# EAGLE design ftdi (EAGLE 6.5.0)
FTDI BREAKOUT
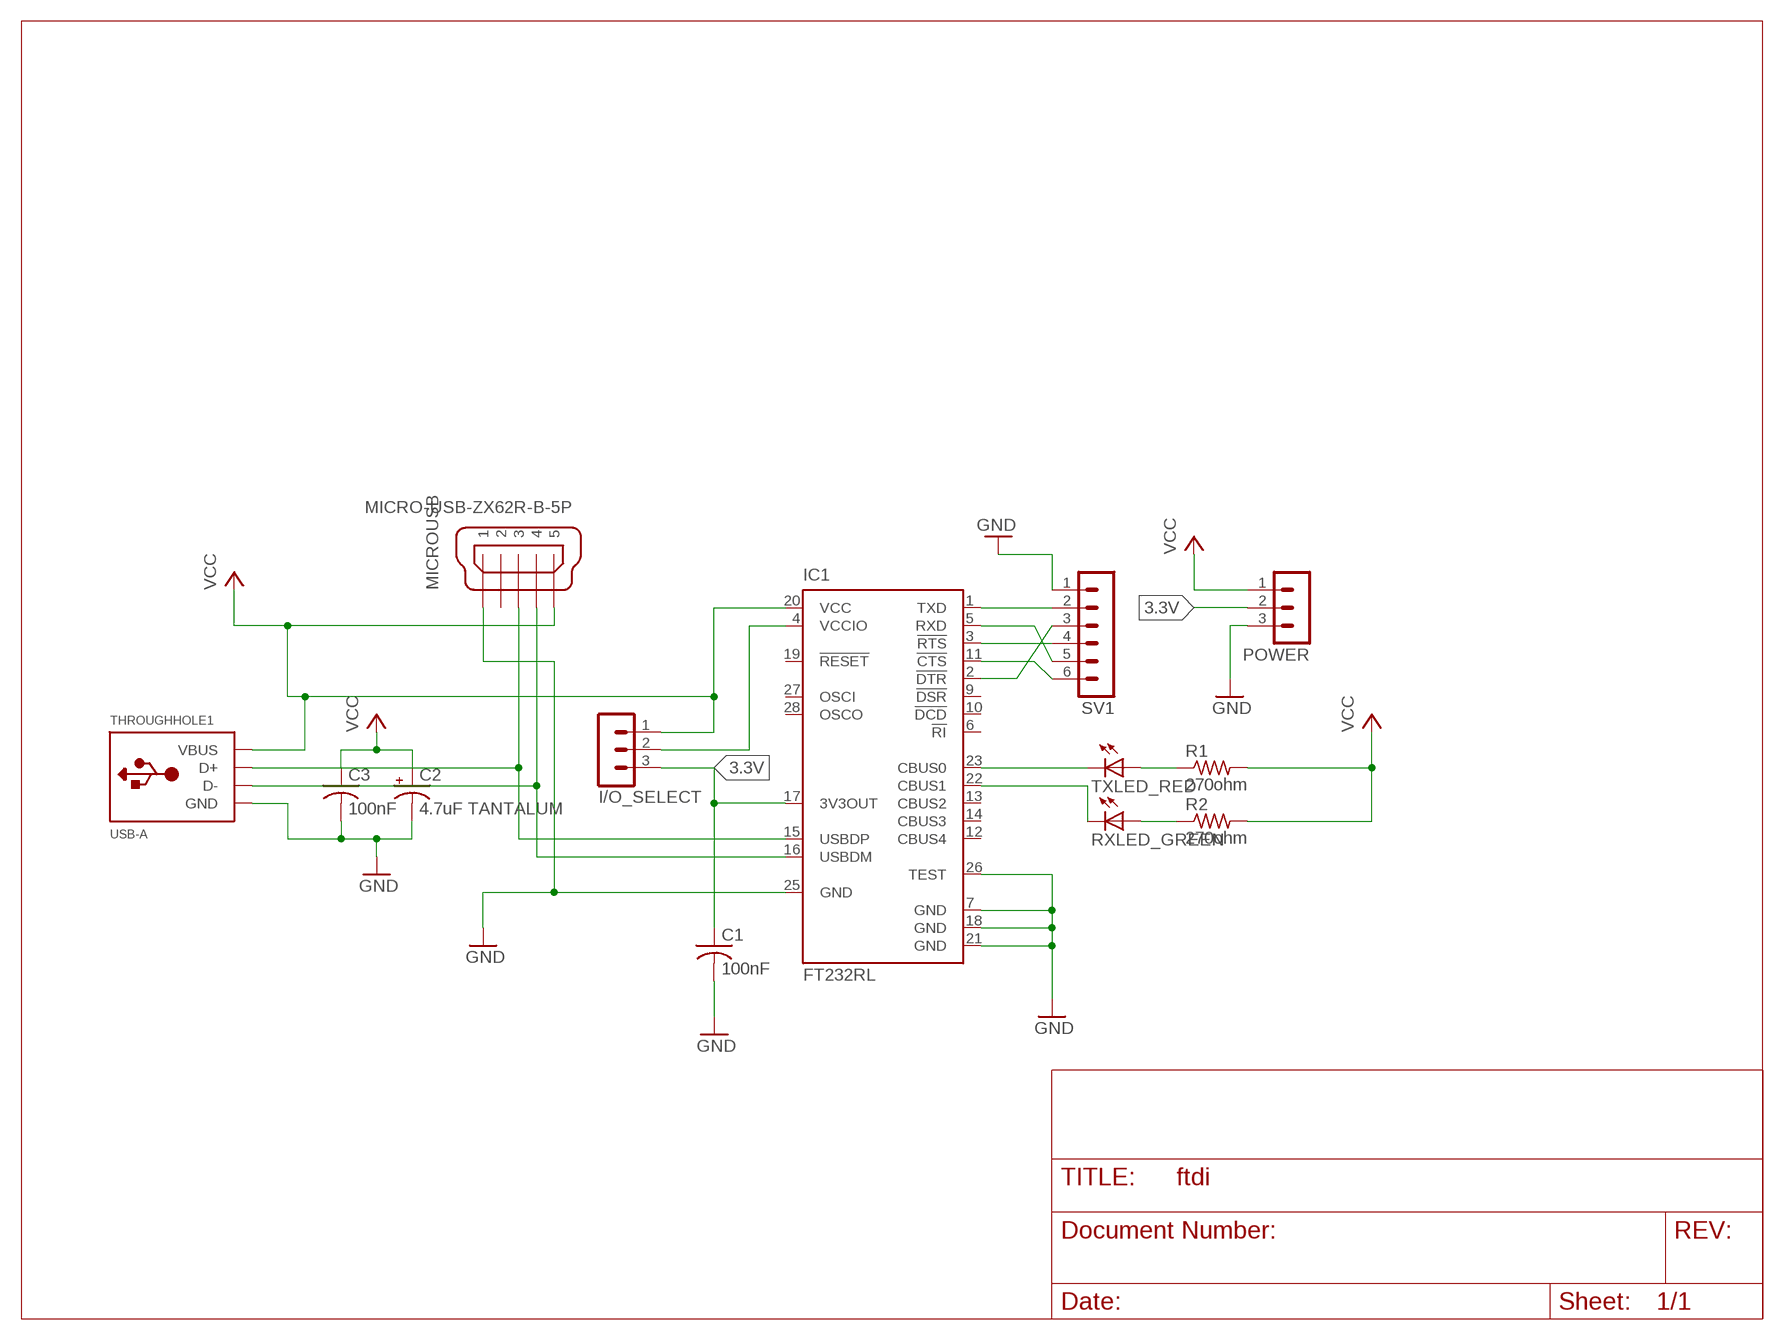
[diagram p0: schematic, sheet 1]

## Parts
C1  100nF  C-USC1206  [C1206]
C2  4.7uF TANTALUM  CPOL-USC/6032-28R  [C/6032-28R]
C3  100nF  C-USC1206  [C1206]
I/O_SELECT  MA03-1  [MA03-1]
IC1  FT232RL  [SSOP28]
MICROUSB  MICRO-USB-ZX62R-B-5P  [ZX62R-B-5P]
POWER  MA03-1  [MA03-1]
R1  270ohm  R-US_R1206  [R1206]
R2  270ohm  R-US_R1206  [R1206]
RXLED_GREEN  LED3MM  [LED3MM]
SV1  MA06-1  [MA06-1]
THROUGHHOLE1  USB-A  [MOLEX_480371000]
TXLED_RED  LED3MM  [LED3MM]

## Nets
3.3V: C1.1 I/O_SELECT.3 IC1.17(3V3OUT) POWER.2
GND: C1.2 C2.- C3.2 IC1.7(GND) IC1.18(GND) IC1.21(GND) IC1.25(GND) IC1.26(TEST) MICROUSB.1 POWER.3 SV1.1 THROUGHHOLE1.P$4(GND)
N$1: IC1.1(TXD) SV1.2
N$2: IC1.16(USBDM) MICROUSB.4 THROUGHHOLE1.P$2(D-)
N$3: IC1.15(USBDP) MICROUSB.3 THROUGHHOLE1.P$3(D+)
N$4: IC1.23(CBUS0) TXLED_RED.K(C)
N$6: I/O_SELECT.2 IC1.4(VCCIO)
N$7: R1.1 TXLED_RED.A
N$8: R2.1 RXLED_GREEN.A
N$9: IC1.2(!DTR) SV1.3
N$10: IC1.3(!RTS) SV1.4
N$11: IC1.5(RXD) SV1.5
N$12: IC1.11(!CTS) SV1.6
RXLED_RED: IC1.22(CBUS1) RXLED_GREEN.K(C)
VCC: C2.+ C3.1 I/O_SELECT.1 IC1.20(VCC) MICROUSB.5 POWER.1 R1.2 R2.2 THROUGHHOLE1.P$1(VBUS)
Unconnected: IC1.6(!RI) IC1.9(!DSR) IC1.10(!DCD) IC1.12(CBUS4) IC1.13(CBUS2) IC1.14(CBUS3) IC1.19(!RESET) IC1.27(OSCI) IC1.28(OSCO) MICROUSB.2

## Library data of the parts
C1 C3 = adafruit:C-US: CAPACITOR, American symbol
C2 = adafruit:CPOL-US: POLARIZED CAPACITOR, American symbol
I/O_SELECT POWER = con-lstb:MA03-1: PIN HEADER; OC_FARNELL: unknown; OC_NEWARK: unknown
IC1 = ftdichip:FT232R: Source: http://www.ftdichip.com/Documents/DataSheets/DS_FT232R_v104.pdf; MPN: FT232RL; OC_FARNELL: 1146032; OC_NEWARK: 91K9918
MICROUSB = con-hirose:MICRO-USB-: Hirose Micro USB Connector ZX62R-B-5P: Micro B, reverse (top mount) shell SMT Supplier: DigiKey H11574CT-ND Source: http://www.hirose.co.jp/cataloge_hp/e24200011.pdf
R1 R2 = adafruit:R-US_: RESISTOR, American symbol
RXLED_GREEN TXLED_RED = adafruit:LED: LED OSRAM: - CHIPLED LG R971, LG N971, LY N971, LG Q971, LY Q971, LO R971, LY R971 LH N974, LH R974 LS Q976, LO Q976, LY Q976 LO Q996 - Hyper CHIPLED LW Q18S LB Q993, LB Q99A, LB R99A - SideLED LS A670, LO A670, LY A670, LG A670, LP A670 LB A673, LV A673, LT A673, LW A673 LH A674 LY A675 LS A676, LA A676, LO A676, LY A676, LW A676 LS A679, LY A679, LG A679 - Hyper Micro SIDELED® LS Y876, LA Y876, LO Y876, LY Y876 LT Y87S - SmartLED LW L88C, LW L88S LB L89C, LB L89S, LG L890 LS L89K, LO L89K, LY L89K LS L896, LA L896, LO L896, LY L896 - TOPLED LS T670, LO T670, LY T670, LG T670, LP T670 LSG T670, LSP T670, LSY T670, LOP T670, LYG T670 LG T671, LOG T671, LSG T671 LB T673, LV T673, LT T673, LW T673 LH T674 LS T676, LA T676, LO T676, LY T676, LB T676, LH T676, LSB T676, LW T676 LB T67C, LV T67C, LT T67C, LS T67K, LO T67K, LY T67K, LW E67C LS E67B, LA E67B, LO E67B, LY E67B, LB E67C, LV E67C, LT E67C LW T67C LS T679, LY T679, LG T679 LS T770, LO T770, LY T770, LG T770, LP T770 LB T773, LV T773, LT T773, LW T773 LH T774 LS E675, LA E675, LY E675, LS T675 LS T776, LA T776, LO T776, LY T776, LB T776 LHGB T686 LT T68C, LB T68C - Hyper Mini TOPLED® LB M676 - Mini TOPLED Santana® LG M470 LS M47K, LO M47K, LY M47K Source: http://www.osram.convergy.de/
SV1 = con-lstb:MA06-1: PIN HEADER; OC_FARNELL: unknown; OC_NEWARK: unknown
THROUGHHOLE1 = adafruit_usb_a_through_hole:USB-A: USB type A 'plug' Used for things that can directly connect to a USB port, say USB key

## Board
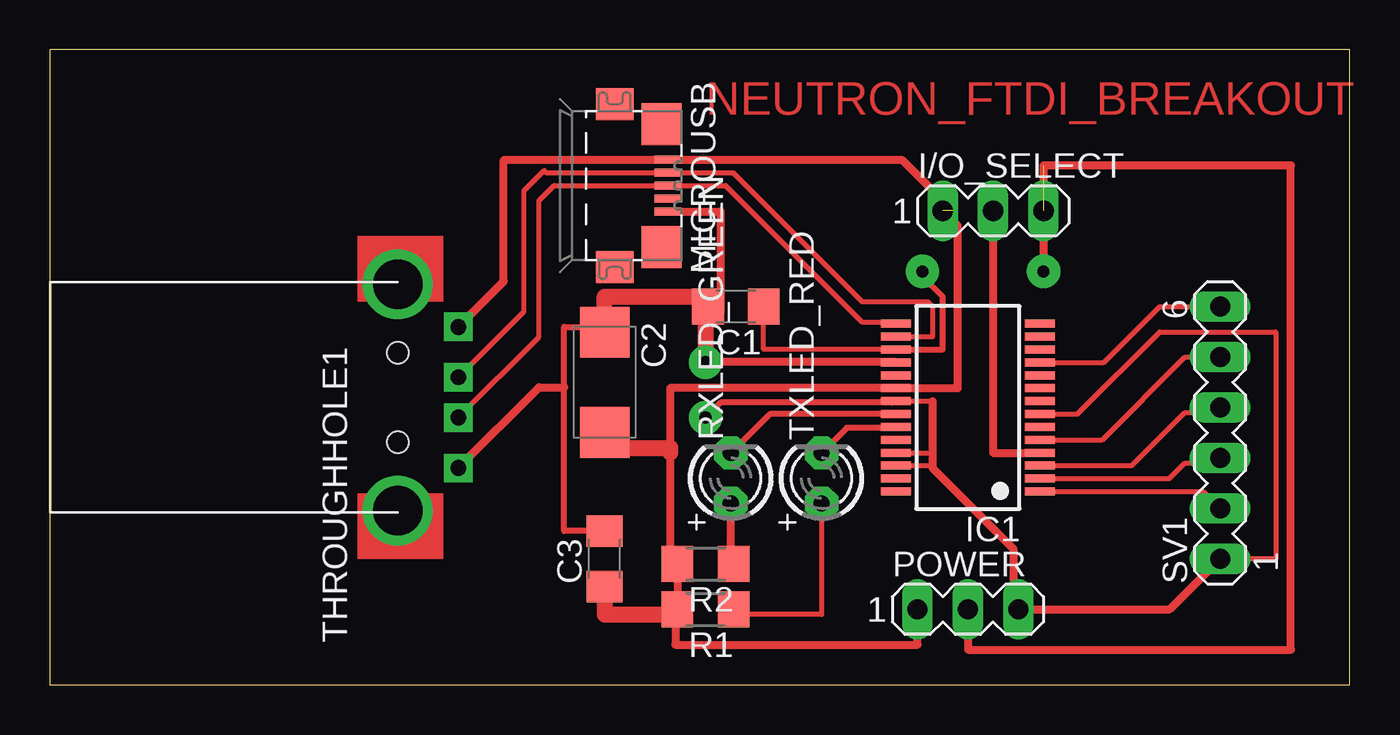
[diagram p1: board, top side]
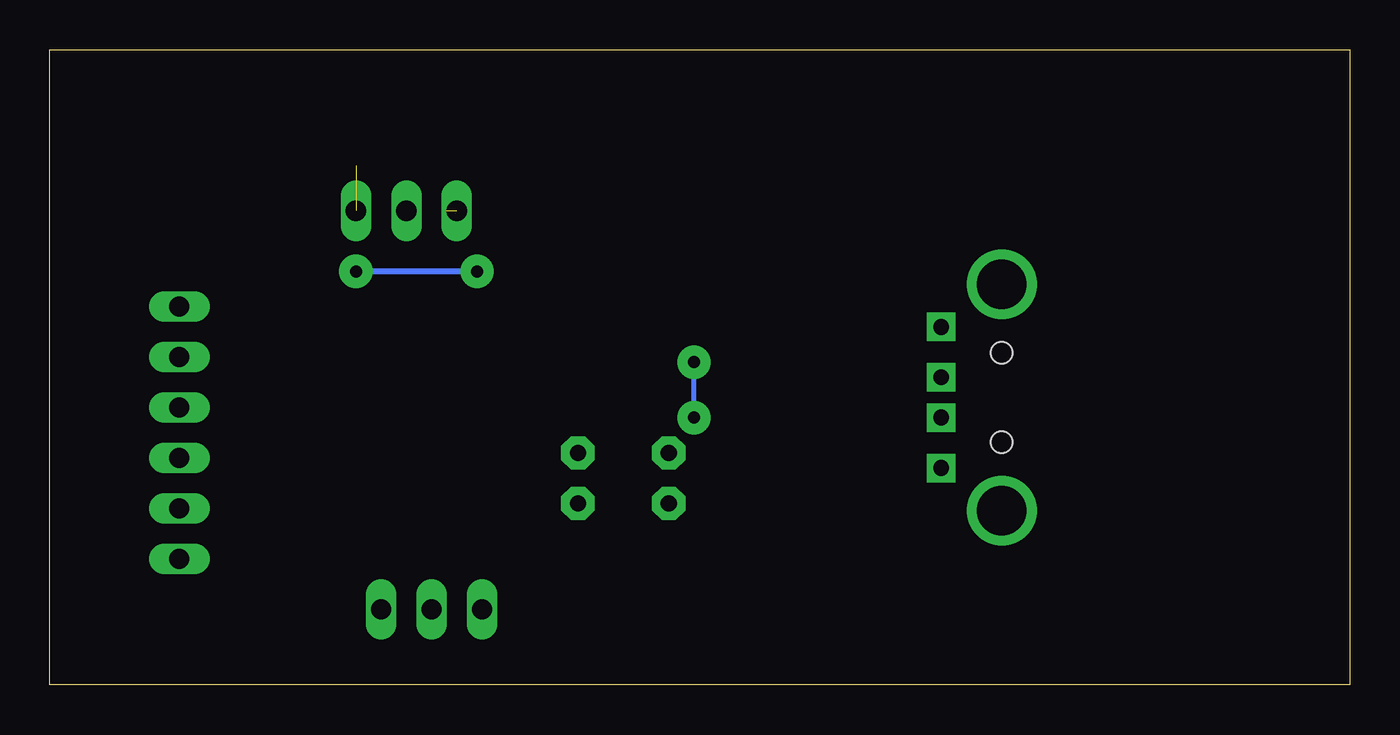
[diagram p2: board, bottom side, seen from below]

Size 65.46 x 31.99 mm. Coordinates in mm from the lower left corner, seen from the top.
Outline: 0,0 65.46,0 65.46,31.99 0,31.99 0,0
Copper layers (1*16): Top 0.035mm / dielectric 1.5mm / Bottom 0.035mm
Design rules "default": minimum track width 10mil, minimum drill 24mil, track to track 8mil, track to pad 8mil, pad to pad 8mil, via to via 8mil, smd to smd 8mil, copper to edge 40mil, drill to drill 8mil, minimum pad ring 10mil, minimum via ring 8mil, stop-mask expansion 4mil, vias tented up to drill 0mil, thermal gap 10mil

### Footprints (pad centres in the part's own frame; a part is rotated, then mirrored left to right if it is on the bottom)
C1206 = smd 1.6 x 1.8: 1 -1.4,0; 2 1.4,0
C/6032-28R = smd 2.55 x 2.5: + 2.525,0; - -2.525,0
MA03-1 = drill 1.016 long: 1 -2.54,0; 2 0,0; 3 2.54,0
SSOP28 = smd 0.4 x 1.5: 1 -4.225,-3.625; 2 -3.575,-3.625; 3 -2.925,-3.625; 4 -2.275,-3.625; 5 -1.625,-3.625; 6 -0.975,-3.625; 7 -0.325,-3.625; 8 0.325,-3.625; 9 0.975,-3.625; 10 1.625,-3.625; 11 2.275,-3.625; 12 2.925,-3.625; 13 3.575,-3.625; 14 4.225,-3.625; 15 4.225,3.625; 16 3.575,3.625; 17 2.925,3.625; 18 2.275,3.625; 19 1.625,3.625; 20 0.975,3.625; 21 0.325,3.625; 22 -0.325,3.625; 23 -0.975,3.625; 24 -1.625,3.625; 25 -2.275,3.625; 26 -2.925,3.625; 27 -3.575,3.625; 28 -4.225,3.625
ZX62R-B-5P = smd 1.35 x 0.4: 1 2.675,-1.3; 2 2.675,-0.65; 3 2.675,0; 4 2.675,0.65; 5 2.675,1.3 | smd 1.9 x 1.6: M1 0,-4.1; M2 0,4.1 | smd 2 x 2.1: M3 2.35,3.1; M4 2.35,-3.1
R1206 = smd 1.6 x 1.803: 1 -1.422,0; 2 1.422,0
LED3MM = drill 0.813 pad 1.676 octagon: A -1.27,0; K 1.27,0
MA06-1 = drill 1.016 long: 1 -6.35,0; 2 -3.81,0; 3 -1.27,0; 4 1.27,0; 5 3.81,0; 6 6.35,0
MOLEX_480371000 = drill 2.5: M1 -5.7,0; M2 5.7,0 | drill 0.8 pad 1.422 square: P$1 -3.556,3.048; P$2 -1.016,3.048; P$3 1.016,3.048; P$4 3.556,3.048 | hole 1.1: -2.25,0; 2.25,0

### Placement (x,y rotation side)
C1  34.54,19.05 180 top
C2  27.94,15.24 270 top
C3  27.94,6.35 90 top
I/O_SELECT  47.5,23.88 0 top
IC1  46.23,13.97 90 top
MICROUSB  28.45,25.15 0 top
POWER  46.23,3.81 0 top
R1  33.02,3.81 180 top
R2  33.02,6.1 180 top
RXLED_GREEN  34.29,10.41 90 top
SV1  58.93,12.7 90 top
THROUGHHOLE1  17.53,14.48 270 top
TXLED_RED  38.86,10.41 90 top

### Tracks (layer width: path | path; a pad name or v marks a point on that pad's centre or on a via)
3.3V  (via drill 0.6 pad 1.68)  (1 unrouted)
  Top 0.254: IC1.17 35.94,16.89 C1.1
  Top 0.305: IC1.17 44.96,16.89 44.96,19.56 43.94,20.57 v43.94,20.83
  Top 0.406: POWER.2 46.23,1.78 62.48,1.78 62.48,26.16 50.04,26.16 v50.04,20.83
  Bottom 0.305: v43.94,20.83 v50.04,20.83
GND  (via drill 0.6 pad 1.68)
  Top 0.254: IC1.7 51.74,13.64 55.88,17.78 61.72,17.78 61.72,6.35 SV1.1 | 44.45,14.29 IC1.21 42.42,14.22 | IC1.26 44.45,11.04 | IC1.25 44.45,11.7 | 33.02,14.22 v33.02,13.46 | 33.02,16.51 v33.02,16.26 | IC1.18 | C1.2 33.02,19.05
  Top 0.305: 42.42,14.22 33.78,14.22 v33.02,13.46 | C3.2 25.91,7.75 25.91,14.99 25.91,18.03 27.94,18.03 C2.-
  Top 0.406: SV1.1 56.39,3.81 POWER.3 48.51,4.06 48.51,6.86 44.45,10.92 44.45,11.04 44.45,11.7 44.45,14.29 | IC1.18 v33.02,16.26 | 33.02,19.17 C1.2 33.14,18.8 33.78,18.8 33.78,23.85 MICROUSB.1 | THROUGHHOLE1.P$4 24.64,14.99 25.91,14.99
  Top 0.813: C2.- 27.94,19.56 33.14,19.56 C1.2 | 33.02,19.05 v33.02,16.26
  Bottom 0.254: v33.02,13.46 v33.02,16.26
N$1
  Top 0.254: IC1.1 58.07,9.74 SV1.2
N$2
  Top 0.254: IC1.16 42.62,17.53 44.45,17.53 44.45,19.05 44.2,19.3 40.89,19.3 34.4,25.8 MICROUSB.4 25,25.8 24.89,25.91 23.88,24.89 23.88,18.8 THROUGHHOLE1.P$2
N$3
  Top 0.254: IC1.15 42.51,18.29 40.89,18.29 34.04,25.15 MICROUSB.3 25.4,25.15 24.64,24.38 24.64,17.53 THROUGHHOLE1.P$3
N$4
  Top 0.254: 42.6,12.95 IC1.23
  Top 0.305: 42.6,12.95 40.13,12.95 TXLED_RED.K
N$6
  Top 0.406: I/O_SELECT.2 47.5,11.68 49.85,11.68 IC1.4
N$7
  Top 0.254: TXLED_RED.A 38.86,3.56 34.44,3.56 R1.1
N$8
  Top 0.406: R2.1 34.29,6.1 RXLED_GREEN.A
N$9
  Top 0.254: IC1.2 56.37,10.39 57.15,11.18 58.67,11.18 SV1.3
N$10
  Top 0.254: IC1.3 54.48,11.04 57.15,13.72 58.67,13.72 SV1.4
N$11
  Top 0.254: IC1.5 52.98,12.35 57.15,16.51 SV1.5
N$12
  Top 0.254: IC1.11 53.08,16.25 55.88,19.05 SV1.6
RXLED_RED
  Top 0.305: IC1.22 36.25,13.64 RXLED_GREEN.K
VCC  (1 unrouted)
  Top 0.406: R2.2 R1.2 | R1.2 31.5,3.81 31.5,3.3 31.5,2.03 43.69,2.03 POWER.1 | R1.2 31.6,6.6 31.24,6.6 31.24,11.68 31.24,14.95 IC1.20 45.72,14.95 45.72,23.11 45.47,23.37 45.47,23.88 42.9,26.45 MICROUSB.5 22.89,26.45 22.86,26.42 22.86,20.32 THROUGHHOLE1.P$1
  Top 0.813: C2.+ 27.94,11.94 31.24,11.94 31.24,11.68 | C3.1 27.94,3.56 31.5,3.56 31.5,3.3
(copper drawn outside any net)
  shapes: Top area x2

### Text on the board
Top: NEUTRON_FTDI_BREAKOUT